# Altium schematic sheet Top Level.SchDoc
size A4; SheetNumber: 1; SheetTotal: 14
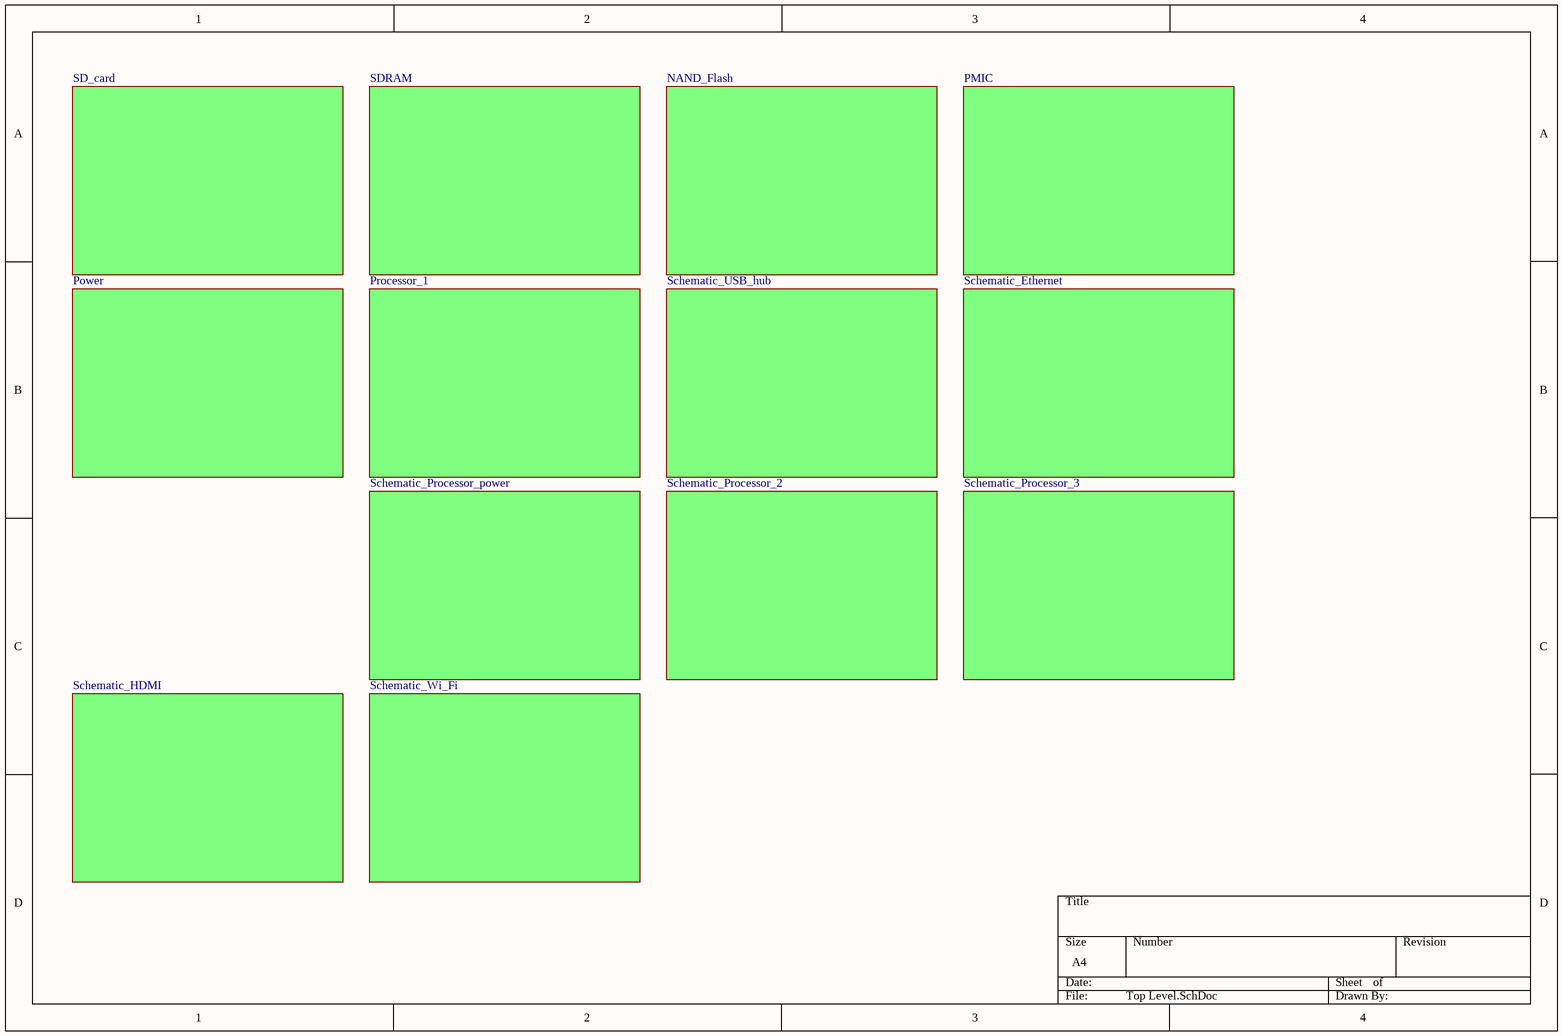
[diagram p0: Top Level.SchDoc]

## Sub-sheets
NAND_Flash = NAND_Flash.SchDoc: no entries
PMIC = PMIC.SchDoc: no entries
Power = Power.SchDoc: no entries
Processor_1 = Processor_1.SchDoc: no entries
Schematic_Ethernet = Ethernet.SchDoc: no entries
Schematic_HDMI = HDMI.SchDoc: no entries
Schematic_Processor_2 = Processor_2.SchDoc: no entries
Schematic_Processor_3 = Processor_3.SchDoc: no entries
Schematic_Processor_power = Processor_power.SchDoc: no entries
Schematic_USB_hub = USB_hub.SchDoc: no entries
Schematic_Wi_Fi = Wi_Fi.SchDoc: no entries
SD_card = SD_card.SchDoc: no entries
SDRAM = SDRAM.SchDoc: no entries